# Altium schematic sheet Power.SchDoc
size A4; SheetNumber: 2; SheetTotal: 2
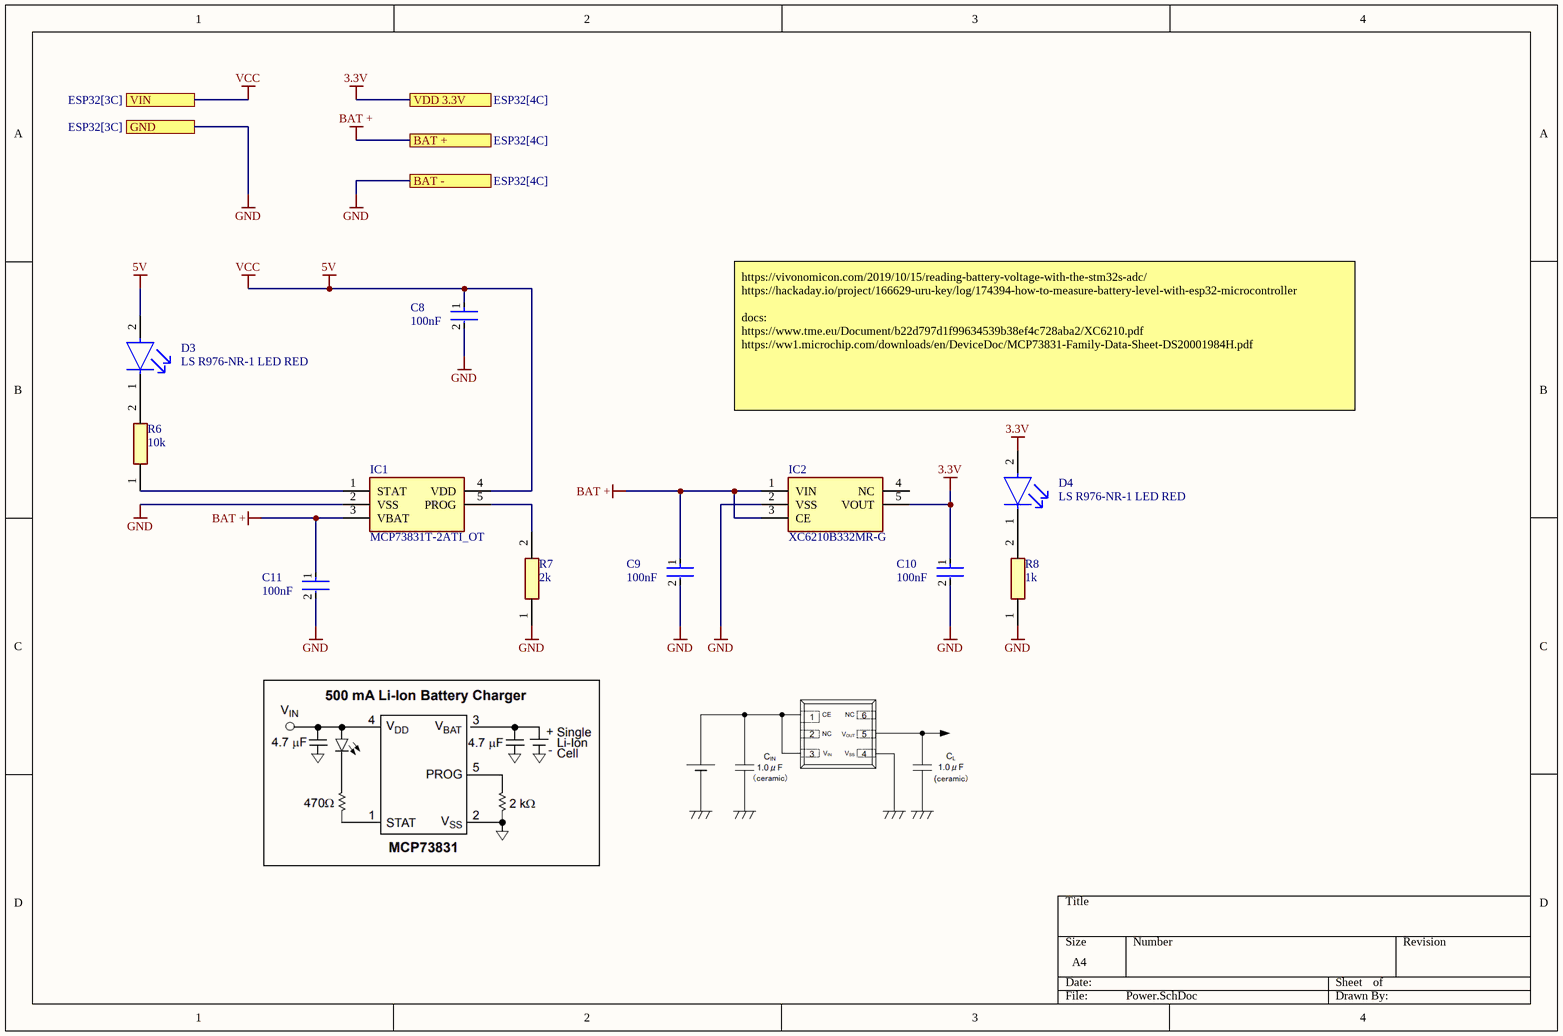
[diagram p0: Power.SchDoc]

## Parts
C8  100nF  [FP-0805-L_2_01_0_2-W_1_25-MFG]
C9  100nF  [FP-0805-L_2_01_0_2-W_1_25-MFG]
C10  100nF  [FP-0805-L_2_01_0_2-W_1_25-MFG]
C11  100nF  [FP-0805-L_2_01_0_2-W_1_25-MFG]
D3  LS R976-NR-1 LED RED  [FP-LS_R976-MFG]
D4  LS R976-NR-1 LED RED  [FP-LS_R976-MFG]
IC1  MCP73831T-2ATI_OT  [SOT95P270X145-5N]
IC2  XC6210B332MR-G  [SOT95P280X130-5N]
R6  10k  [RESC2013X65N]
R7  2k  [RESC2013X65N]
R8  1k  [RESC2013X65N]

## Ports
BAT + (see ESP32[4C]), BAT - (see ESP32[4C]), GND (see ESP32[3C]), VDD 3.3V (see ESP32[4C]), VIN (see ESP32[3C])

## Nets
3.3V: C10.1 D4.2(A) IC2.5(VOUT) ; port VDD 3.3V
5V: C8.1 D3.2(A) IC1.4(VDD) ; port VIN  [also labelled VCC]
BAT +: C9.1 C11.1 IC1.3(VBAT) IC2.1(VIN) IC2.3(CE) ; port BAT +
GND: C8.2 C9.2 C10.2 C11.2 IC1.2(VSS) IC2.2(VSS) R7.1 R8.1 ; port GND, port BAT -
NetD3_1: D3.1(C) R6.2
NetD4_1: D4.1(C) R8.2
NetIC1_1: IC1.1(STAT) R6.1
NetIC1_5: IC1.5(PROG) R7.2

Not connected (* = marked no-connect by the designer): IC2 4(NC)

## Notes on the sheet
- https://vivonomicon.com/2019/10/15/reading-battery-voltage-with-the-stm32s-adc/
  https://hackaday.io/project/166629-uru-key/log/174394-how-to-measure-battery-level-with-esp32-microcontroller
  docs:
  https://www.tme.eu/Document/b22d797d1f99634539b38ef4c728aba2/XC6210.pdf
  https://ww1.microchip.com/downloads/en/DeviceDoc/MCP73831-Family-Data-Sheet-DS20001984H.pdf

## Library data of the parts
C8-C11 = CMP-2007-04762-2: Automotive Ceramic Capacitor, 0805, 100nF, 5%, X7R, 15%, 100V; Construction: Flat; Series: -; Thickness: 0.055inch; Depth: 1.25mm; RoHS Compliant: Yes; Dielectric: X7R; Length: 2.01mm; Weight: 0.000194oz; Width: 0.049inch; Voltage Rating: 100V; Tolerance: 5%; Number of Pins: 2; Height: 1.4mm; Mount: Surface Mount; Ratings: AEC-Q200; Case Code (Metric): 2012; Termination: SMD/SMT; Package Quantity: 2000; Voltage Rating (DC): 100V; Capacitance: 100nF; Min Operating Temperature: -55°C; Max Operating Temperature: 125°C; Case/Package: 0805; Case Code (Imperial): 0805; Lead Free: Lead Free; Packaging: Tape and Reel
D3 D4 = CMP-62016-000037-1: LED RED DIFFUSED 0805 SMD; Lens Size: 1.25mm; Number of LEDs: 1; Luminous Intensity: 180mcd; Dominant Wavelength: 633nm; Lens Style: Flat; Reverse Voltage: 12V; Lens Color: White; Forward Voltage: 2.5V; Forward Current: 25mA; Power Dissipation: 65W; Luminous Flux: 0.47lm; Test Current: 20mA; Viewing Angle: 160°; Length: 2mm; Number of Pins: 2; Lens Transparency: Diffused; Min Operating Temperature: -30°C; Case Code (Metric): 2012; Depth: 1.35mm; Color: Red; Illumination Color: Red; Max Operating Temperature: 85°C; Mount: Surface Mount; Case/Package: 0805; Height: 0.9mm; Package Quantity: 16000; Number of Elements: 1; Radiation Hardening: No; Case Code (Imperial): 0805; Packaging: Tape and Reel; Width: 1.25mm
IC1 = MCP73831T-2ATI_OT: Integrated Circuit; Manufacturer_Name: Microchip; Manufacturer_Part_Number: MCP73831T-2ATI/OT; Datasheet Link: https://datasheet.datasheetarchive.com/originals/distributors/Datasheets-DGA15/727147.pdf; Height: 1.45mm; Mouser Part Number: 579-MCP73831T-2ATIOT; Mouser Price/Stock: https://www.mouser.co.uk/ProductDetail/Microchip-Technology/MCP73831T-2ATI-OT?qs=yUQqVecv4qsZbioEUu%252B83g%3D%3D; Arrow Part Number: MCP73831T-2ATI/OT; Arrow Price/Stock: https://www.arrow.com/en/products/mcp73831t-2atiot/microchip-technology?utm_currency=USD&region=nac
IC2 = XC6210B332MR-G: Integrated Circuit; Manufacturer_Name: Torex; Datasheet Link: https://www.torexsemi.com/file/xc6210/XC6210.pdf; Height: 1.3mm; Manufacturer_Part_Number: XC6210B332MR-G; Mouser Part Number: 865-XC6210B332MR-G; Mouser Price/Stock: https://www.mouser.co.uk/ProductDetail/Torex-Semiconductor/XC6210B332MR-G?qs=AsjdqWjXhJ%2FS4LOuBYdYHQ%3D%3D
R6-R8 = 0805W8F1000T5E: Resistor; Manufacturer_Name: UNI-ROYAL(Uniroyal Elec); Datasheet Link: https://datasheet.lcsc.com/szlcsc/Uniroyal-Elec-0805W8F1000T5E_C17408.pdf; Height: 0.65mm; Manufacturer_Part_Number: 0805W8F1000T5E